# Altium schematic sheet 3_cpu.SchDoc: Microcontroller
size A4; DocumentNumber: 4; SheetNumber: 4; SheetTotal: 11
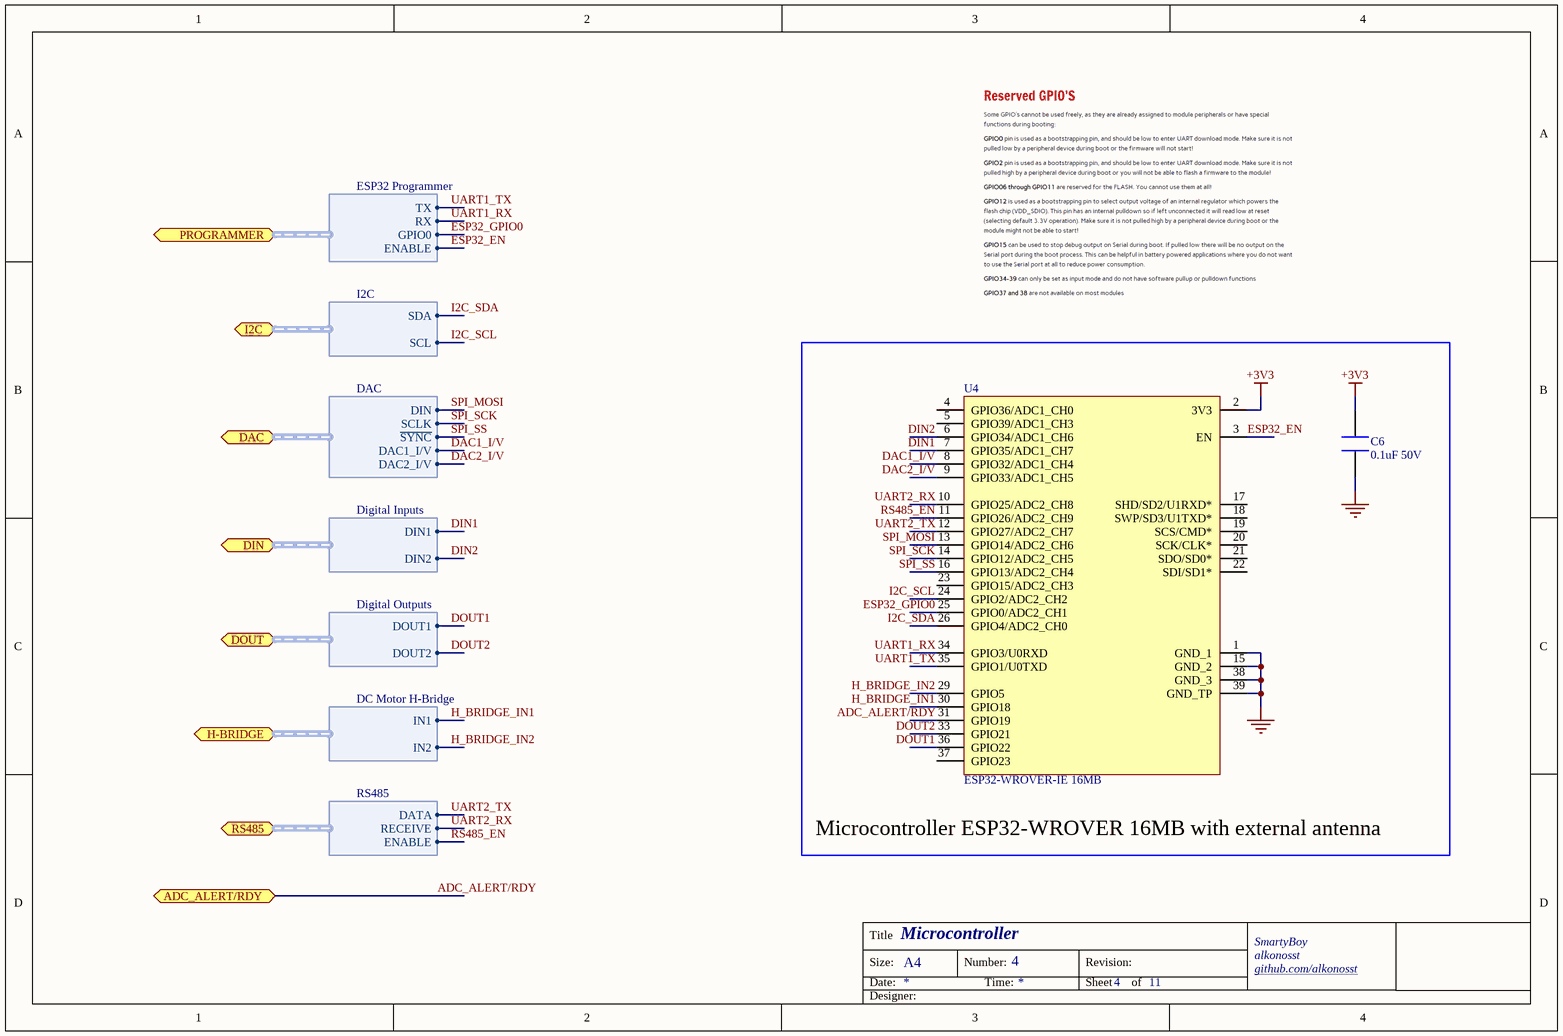
[diagram p0: 3_cpu.SchDoc]

## Parts
C6  0.1uF 50V  [C0603]
U4  ESP32-WROVER-IE 16MB  [ESP32-WROVER-IE]

## Blocks framed on the sheet
Microcontroller ESP32-WROVER 16MB with external antenna: C6 U4

## Ports
ADC_ALERT/RDY (bidir), DAC (bidir, harness DAC), DIN (bidir, harness Digital Inputs), DOUT (bidir, harness Digital Outputs), H-BRIDGE (bidir, harness DC Motor H-Bridge), I2C (bidir, harness I2C), PROGRAMMER (bidir, harness ESP32 Programmer), RS485 (bidir, harness RS485)

## Harnesses
ESP32 Programmer: TX, RX, GPIO0, ENABLE
RS485: DATA, RECEIVE, ENABLE
DAC: DIN, SCLK, ~{SYNC}, DAC1_I/V, DAC2_I/V
DC Motor H-Bridge: IN1, IN2
Digital Inputs: DIN1, DIN2
Digital Outputs: DOUT1, DOUT2
I2C: SDA, SCL

## Nets
+3V3: C6.1 U4.2(3V3)
GND: C6.2 U4.1(GND_1) U4.15(GND_2) U4.38(GND_3) U4.39(GND_TP)
ADC_ALERT/RDY: U4.31(GPIO19) ; port ADC_ALERT/RDY
DAC1_I/V: U4.8(GPIO32/ADC1_CH4) ; port DAC.DAC1_I/V
DAC2_I/V: U4.9(GPIO33/ADC1_CH5) ; port DAC.DAC2_I/V
DIN1: U4.7(GPIO35/ADC1_CH7) ; port DIN.DIN1
DIN2: U4.6(GPIO34/ADC1_CH6) ; port DIN.DIN2
DOUT1: U4.36(GPIO22) ; port DOUT.DOUT1
DOUT2: U4.33(GPIO21) ; port DOUT.DOUT2
ESP32_EN: U4.3(EN) ; port PROGRAMMER.ENABLE
ESP32_GPIO0: U4.25(GPIO0/ADC2_CH1) ; port PROGRAMMER.GPIO0
H_BRIDGE_IN1: U4.30(GPIO18) ; port H-BRIDGE.IN1
H_BRIDGE_IN2: U4.29(GPIO5) ; port H-BRIDGE.IN2
I2C_SCL: U4.24(GPIO2/ADC2_CH2) ; port I2C.SCL
I2C_SDA: U4.26(GPIO4/ADC2_CH0) ; port I2C.SDA
RS485_EN: U4.11(GPIO26/ADC2_CH9) ; port RS485.ENABLE
SPI_MOSI: U4.13(GPIO14/ADC2_CH6) ; port DAC.DIN
SPI_SCK: U4.14(GPIO12/ADC2_CH5) ; port DAC.SCLK
SPI_SS: U4.16(GPIO13/ADC2_CH4) ; port DAC.~{SYNC}
UART1_RX: U4.34(GPIO3/U0RXD) ; port PROGRAMMER.RX
UART1_TX: U4.35(GPIO1/U0TXD) ; port PROGRAMMER.TX
UART2_RX: U4.10(GPIO25/ADC2_CH8) ; port RS485.RECEIVE
UART2_TX: U4.12(GPIO27/ADC2_CH7) ; port RS485.DATA

Not connected (* = marked no-connect by the designer): U4 4(GPIO36/ADC1_CH0) 5(GPIO39/ADC1_CH3) 17(SHD/SD2/U1RXD*) 18(SWP/SD3/U1TXD*) 19(SCS/CMD*) 20(SCK/CLK*) 21(SDO/SD0*) 22(SDI/SD1*) 23(GPIO15/ADC2_CH3) 37(GPIO23)

## Notes on the sheet
- Title
- Size:
- Date:
- A4
- Number:
- Time:
- Revision:
- Sheet
- of
- SmartyBoy
- alkonosst
- github.com/alkonosst <http://github.com/alkonosst>
- Designer:

## Library data of the parts
C6 = CC0603KRX7R9BB104: X7R 100nF ±10% 50V 0603 Multilayer Ceramic Capacitors MLCC - SMD/SMT; LCSC part: C14663; Category: Capacitors: Multilayer Ceramic Capacitors MLCC - SMD/SMT
U4 = ESP32-WROVER-IE(16MB): RX TXRX MOD WIFI EXT IPEX SMD; LCSC part: C701352; Category: IoT/Communication Modules: WiFi Modules